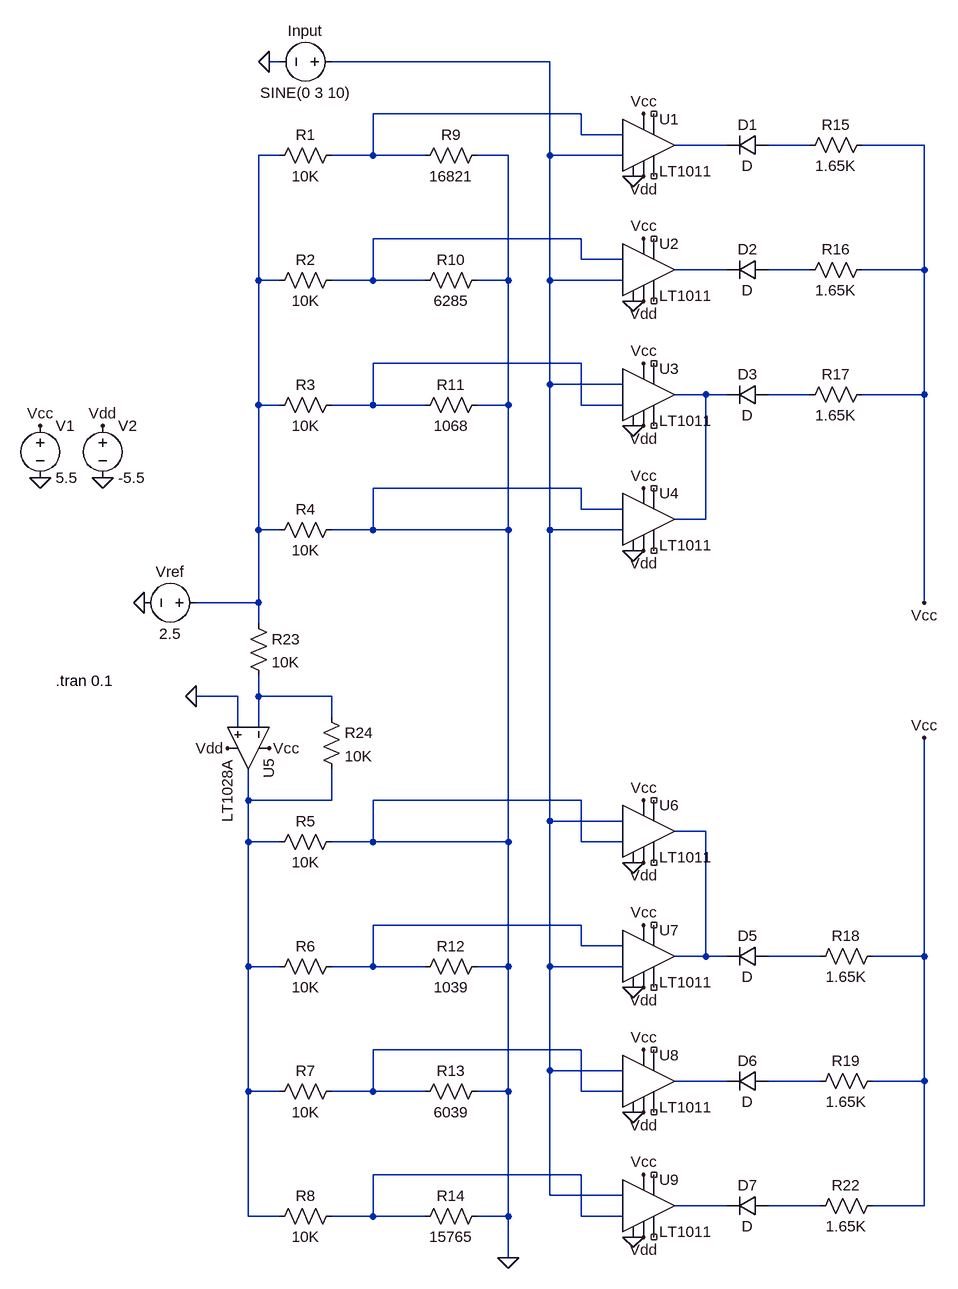
[diagram p0: schematic Komparator.asc]
Komparator.asc, the LTspice schematic file:
Version 4
SHEET 1 996 1940
WIRE -32 32 -48 32
WIRE 384 32 48 32
WIRE 432 112 112 112
WIRE 432 144 432 112
WIRE 496 144 432 144
WIRE 656 160 576 160
WIRE 784 160 720 160
WIRE 960 160 864 160
WIRE -32 176 -64 176
WIRE 112 176 112 112
WIRE 112 176 48 176
WIRE 192 176 112 176
WIRE 320 176 272 176
WIRE 384 176 384 32
WIRE 496 176 384 176
WIRE 432 304 112 304
WIRE 432 336 432 304
WIRE 496 336 432 336
WIRE 656 352 576 352
WIRE 784 352 720 352
WIRE 960 352 960 160
WIRE 960 352 864 352
WIRE -64 368 -64 176
WIRE -32 368 -64 368
WIRE 112 368 112 304
WIRE 112 368 48 368
WIRE 192 368 112 368
WIRE 320 368 320 176
WIRE 320 368 272 368
WIRE 384 368 384 176
WIRE 496 368 384 368
WIRE 432 496 112 496
WIRE 384 528 384 368
WIRE 496 528 384 528
WIRE 624 544 576 544
WIRE 656 544 624 544
WIRE 784 544 720 544
WIRE 960 544 960 352
WIRE 960 544 864 544
WIRE -64 560 -64 368
WIRE -32 560 -64 560
WIRE 112 560 112 496
WIRE 112 560 48 560
WIRE 192 560 112 560
WIRE 320 560 320 368
WIRE 320 560 272 560
WIRE 432 560 432 496
WIRE 496 560 432 560
WIRE 432 688 112 688
WIRE 432 720 432 688
WIRE 496 720 432 720
WIRE 624 736 624 544
WIRE 624 736 576 736
WIRE -64 752 -64 560
WIRE -32 752 -64 752
WIRE 112 752 112 688
WIRE 112 752 48 752
WIRE 320 752 320 560
WIRE 320 752 112 752
WIRE 384 752 384 528
WIRE 496 752 384 752
WIRE -64 864 -64 752
WIRE -64 864 -160 864
WIRE 960 864 960 544
WIRE -64 896 -64 864
WIRE -96 1008 -160 1008
WIRE -64 1008 -64 976
WIRE 48 1008 -64 1008
WIRE 48 1040 48 1008
WIRE -96 1056 -96 1008
WIRE -64 1056 -64 1008
WIRE -80 1168 -80 1120
WIRE 48 1168 48 1120
WIRE 48 1168 -80 1168
WIRE 432 1168 112 1168
WIRE 384 1200 384 752
WIRE 496 1200 384 1200
WIRE 624 1216 576 1216
WIRE -80 1232 -80 1168
WIRE -32 1232 -80 1232
WIRE 112 1232 112 1168
WIRE 112 1232 48 1232
WIRE 320 1232 320 752
WIRE 320 1232 112 1232
WIRE 432 1232 432 1168
WIRE 496 1232 432 1232
WIRE 432 1360 112 1360
WIRE 432 1392 432 1360
WIRE 496 1392 432 1392
WIRE 624 1408 624 1216
WIRE 624 1408 576 1408
WIRE 656 1408 624 1408
WIRE 800 1408 720 1408
WIRE 960 1408 960 1072
WIRE 960 1408 880 1408
WIRE -80 1424 -80 1232
WIRE -32 1424 -80 1424
WIRE 112 1424 112 1360
WIRE 112 1424 48 1424
WIRE 192 1424 112 1424
WIRE 320 1424 320 1232
WIRE 320 1424 272 1424
WIRE 384 1424 384 1200
WIRE 496 1424 384 1424
WIRE 432 1552 112 1552
WIRE 384 1584 384 1424
WIRE 496 1584 384 1584
WIRE 656 1600 576 1600
WIRE 800 1600 720 1600
WIRE 960 1600 960 1408
WIRE 960 1600 880 1600
WIRE -80 1616 -80 1424
WIRE -32 1616 -80 1616
WIRE 112 1616 112 1552
WIRE 112 1616 48 1616
WIRE 192 1616 112 1616
WIRE 320 1616 320 1424
WIRE 320 1616 272 1616
WIRE 432 1616 432 1552
WIRE 496 1616 432 1616
WIRE 432 1744 112 1744
WIRE 384 1776 384 1584
WIRE 496 1776 384 1776
WIRE 656 1792 576 1792
WIRE 800 1792 720 1792
WIRE 960 1792 960 1600
WIRE 960 1792 880 1792
WIRE -80 1808 -80 1616
WIRE -32 1808 -80 1808
WIRE 112 1808 112 1744
WIRE 112 1808 48 1808
WIRE 192 1808 112 1808
WIRE 320 1808 320 1616
WIRE 320 1808 272 1808
WIRE 432 1808 432 1744
WIRE 496 1808 432 1808
WIRE 320 1872 320 1808
FLAG -48 32 0
FLAG 528 304 Vcc
FLAG 528 112 Vcc
FLAG 528 208 Vdd
FLAG 528 400 Vdd
FLAG 512 208 0
FLAG 512 400 0
FLAG 512 592 0
FLAG 512 784 0
FLAG 960 864 Vcc
FLAG 960 1072 Vcc
FLAG 528 496 Vcc
FLAG 528 688 Vcc
FLAG 528 1168 Vcc
FLAG 528 1360 Vcc
FLAG 528 1552 Vcc
FLAG 528 1744 Vcc
FLAG 528 784 Vdd
FLAG 528 1264 Vdd
FLAG 528 1456 Vdd
FLAG 528 1648 Vdd
FLAG 528 1840 Vdd
FLAG 512 1264 0
FLAG 512 1456 0
FLAG 512 1648 0
FLAG 512 1840 0
FLAG 320 1872 0
FLAG -400 592 Vcc
FLAG -240 864 0
FLAG -160 1008 0
FLAG -400 672 0
FLAG -304 672 0
FLAG -304 592 Vdd
FLAG -112 1088 Vdd
FLAG -48 1088 Vcc
FLAG 528 592 Vdd
SYMBOL Comparators/LT1011 528 160 R0
SYMATTR InstName U1
SYMBOL Comparators/LT1011 528 352 R0
SYMATTR InstName U2
SYMBOL diode 720 144 R90
WINDOW 0 0 32 VBottom 2
WINDOW 3 32 32 VTop 2
SYMATTR InstName D1
SYMBOL res 288 160 R90
WINDOW 0 0 56 VBottom 2
WINDOW 3 32 56 VTop 2
SYMATTR InstName R9
SYMATTR Value 16821
SYMBOL res 64 160 R90
WINDOW 0 0 56 VBottom 2
WINDOW 3 32 56 VTop 2
SYMATTR InstName R1
SYMATTR Value 10K
SYMBOL voltage 64 32 R90
WINDOW 0 -32 56 VBottom 2
WINDOW 3 32 56 VTop 2
SYMATTR InstName Input
SYMATTR Value SINE(0 3 10)
SYMBOL res 880 144 R90
WINDOW 0 0 56 VBottom 2
WINDOW 3 32 56 VTop 2
SYMATTR InstName R15
SYMATTR Value 1.65K
SYMBOL res 288 352 R90
WINDOW 0 0 56 VBottom 2
WINDOW 3 32 56 VTop 2
SYMATTR InstName R10
SYMATTR Value 6285
SYMBOL res 64 352 R90
WINDOW 0 0 56 VBottom 2
WINDOW 3 32 56 VTop 2
SYMATTR InstName R2
SYMATTR Value 10K
SYMBOL res 880 336 R90
WINDOW 0 0 56 VBottom 2
WINDOW 3 32 56 VTop 2
SYMATTR InstName R16
SYMATTR Value 1.65K
SYMBOL diode 720 336 R90
WINDOW 0 0 32 VBottom 2
WINDOW 3 32 32 VTop 2
SYMATTR InstName D2
SYMBOL Comparators/LT1011 528 544 R0
SYMATTR InstName U3
SYMBOL Comparators/LT1011 528 736 R0
SYMATTR InstName U4
SYMBOL res 64 544 R90
WINDOW 0 0 56 VBottom 2
WINDOW 3 32 56 VTop 2
SYMATTR InstName R3
SYMATTR Value 10K
SYMBOL res 288 544 R90
WINDOW 0 0 56 VBottom 2
WINDOW 3 32 56 VTop 2
SYMATTR InstName R11
SYMATTR Value 1068
SYMBOL res 64 736 R90
WINDOW 0 0 56 VBottom 2
WINDOW 3 32 56 VTop 2
SYMATTR InstName R4
SYMATTR Value 10K
SYMBOL res 880 528 R90
WINDOW 0 0 56 VBottom 2
WINDOW 3 32 56 VTop 2
SYMATTR InstName R17
SYMATTR Value 1.65K
SYMBOL diode 720 528 R90
WINDOW 0 0 32 VBottom 2
WINDOW 3 32 32 VTop 2
SYMATTR InstName D3
SYMBOL res -80 880 R0
SYMATTR InstName R23
SYMATTR Value 10K
SYMBOL res 32 1024 R0
SYMATTR InstName R24
SYMATTR Value 10K
SYMBOL Opamps/LT1028A -16 1088 R90
SYMATTR InstName U5
SYMBOL res 64 1216 R90
WINDOW 0 0 56 VBottom 2
WINDOW 3 32 56 VTop 2
SYMATTR InstName R5
SYMATTR Value 10K
SYMBOL Comparators/LT1011 528 1216 R0
SYMATTR InstName U6
SYMBOL Comparators/LT1011 528 1408 R0
SYMATTR InstName U7
SYMBOL Comparators/LT1011 528 1600 R0
SYMATTR InstName U8
SYMBOL Comparators/LT1011 528 1792 R0
SYMATTR InstName U9
SYMBOL res 64 1408 R90
WINDOW 0 0 56 VBottom 2
WINDOW 3 32 56 VTop 2
SYMATTR InstName R6
SYMATTR Value 10K
SYMBOL res 288 1408 R90
WINDOW 0 0 56 VBottom 2
WINDOW 3 32 56 VTop 2
SYMATTR InstName R12
SYMATTR Value 1039
SYMBOL res 64 1600 R90
WINDOW 0 0 56 VBottom 2
WINDOW 3 32 56 VTop 2
SYMATTR InstName R7
SYMATTR Value 10K
SYMBOL res 288 1600 R90
WINDOW 0 0 56 VBottom 2
WINDOW 3 32 56 VTop 2
SYMATTR InstName R13
SYMATTR Value 6039
SYMBOL res 64 1792 R90
WINDOW 0 0 56 VBottom 2
WINDOW 3 32 56 VTop 2
SYMATTR InstName R8
SYMATTR Value 10K
SYMBOL res 288 1792 R90
WINDOW 0 0 56 VBottom 2
WINDOW 3 32 56 VTop 2
SYMATTR InstName R14
SYMATTR Value 15765
SYMBOL diode 720 1392 R90
WINDOW 0 0 32 VBottom 2
WINDOW 3 32 32 VTop 2
SYMATTR InstName D5
SYMBOL diode 720 1584 R90
WINDOW 0 0 32 VBottom 2
WINDOW 3 32 32 VTop 2
SYMATTR InstName D6
SYMBOL diode 720 1776 R90
WINDOW 0 0 32 VBottom 2
WINDOW 3 32 32 VTop 2
SYMATTR InstName D7
SYMBOL res 896 1392 R90
WINDOW 0 0 56 VBottom 2
WINDOW 3 32 56 VTop 2
SYMATTR InstName R18
SYMATTR Value 1.65K
SYMBOL res 896 1584 R90
WINDOW 0 0 56 VBottom 2
WINDOW 3 32 56 VTop 2
SYMATTR InstName R19
SYMATTR Value 1.65K
SYMBOL res 896 1776 R90
WINDOW 0 0 56 VBottom 2
WINDOW 3 32 56 VTop 2
SYMATTR InstName R22
SYMATTR Value 1.65K
SYMBOL voltage -144 864 R90
WINDOW 0 -32 56 VBottom 2
WINDOW 3 32 56 VTop 2
SYMATTR InstName Vref
SYMATTR Value 2.5
SYMBOL voltage -304 576 R0
SYMATTR InstName V2
SYMATTR Value -5.5
SYMBOL voltage -400 576 R0
SYMATTR InstName V1
SYMATTR Value 5.5
TEXT -376 984 Left 2 !.tran 0.1

The netlist it stands for:
* Komparator.asc
XU1 0 N001 N002 Vdd NC_01 NC_02 N003 Vcc LT1011
XU2 0 N001 N006 Vdd NC_03 NC_04 N007 Vcc LT1011
D1 N004 N003 D
R9 0 N002 16821
R1 N002 N005 10K
V§Input N001 0 SINE(0 3 10)
R15 Vcc N004 1.65K
R10 0 N006 6285
R2 N006 N005 10K
R16 Vcc N008 1.65K
D2 N008 N007 D
XU3 0 N009 N001 Vdd NC_05 NC_06 N010 Vcc LT1011
XU4 0 N001 0 Vdd NC_07 NC_08 N010 Vcc LT1011
R3 N009 N005 10K
R11 0 N009 1068
R4 0 N005 10K
R17 Vcc N011 1.65K
D3 N011 N010 D
R23 N005 N012 10K
R24 N012 N013 10K
XU5 0 N012 Vcc Vdd N013 LT1028A  ; pins In+ In- V+ V- OUT
R5 0 N013 10K
XU6 0 0 N001 Vdd NC_09 NC_10 N014 Vcc LT1011
XU7 0 N001 N015 Vdd NC_11 NC_12 N014 Vcc LT1011
XU8 0 N017 N001 Vdd NC_13 NC_14 N018 Vcc LT1011
XU9 0 N020 N001 Vdd NC_15 NC_16 N021 Vcc LT1011
R6 N015 N013 10K
R12 0 N015 1039
R7 N017 N013 10K
R13 0 N017 6039
R8 N020 N013 10K
R14 0 N020 15765
D5 N016 N014 D
D6 N019 N018 D
D7 N022 N021 D
R18 Vcc N016 1.65K
R19 Vcc N019 1.65K
R22 Vcc N022 1.65K
Vref N005 0 2.5
V2 Vdd 0 -5.5
V1 Vcc 0 5.5
.model D D
.lib standard.dio
.tran 0.1
.lib LTC1.lib
.backanno
.end